# EAGLE design Plata1 (EAGLE 7.5.0)
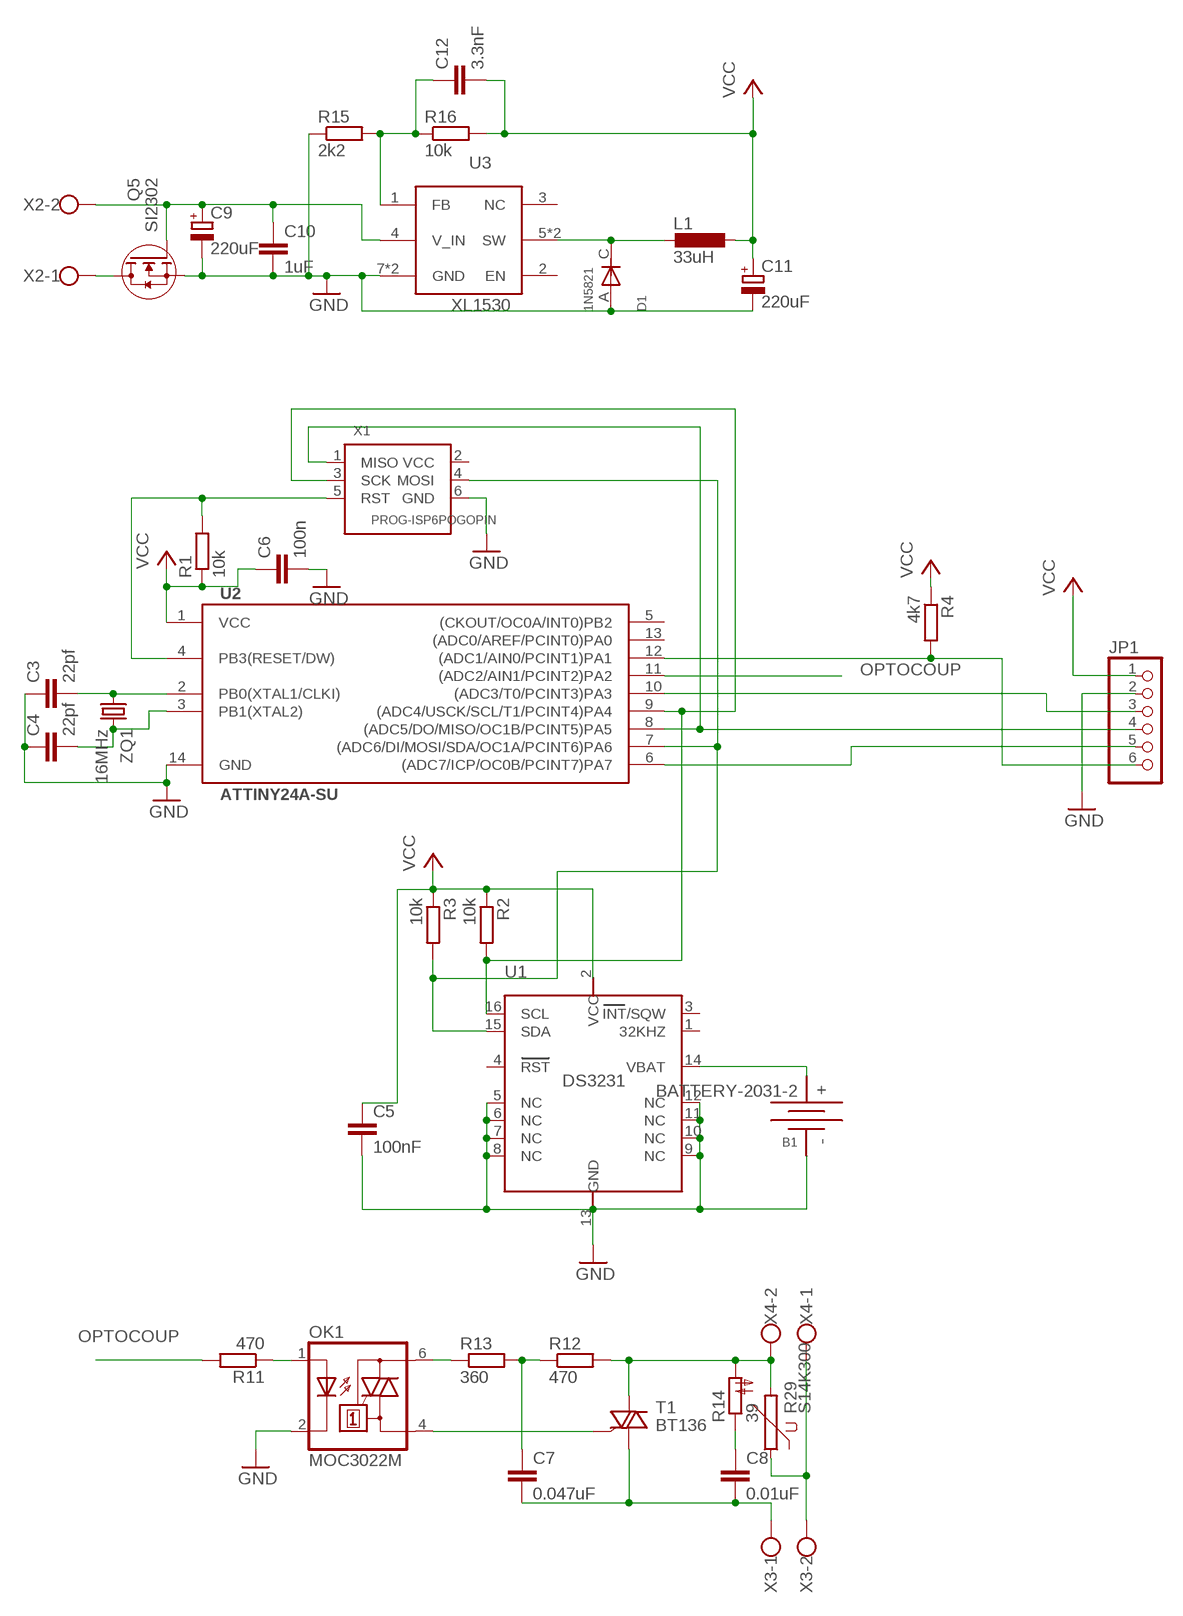
[diagram p0: schematic, sheet 1]

## Parts
B1  BATTERY-2031-2  [BTH2032-2]
C3  22pf  C-EUC0603  [C0603]
C4  22pf  C-EUC0603  [C0603]
C5  100nF  C-EUC0603  [C0603]
C6  100n  C-EUC0603  [C0603]
C7  0.047uF  C-EU150-054X183  [C150-054X183]
C8  0.01uF  C-EU102-043X133  [C102-043X133]
C9  220uF  CPOL-EUE2,5-6E  [E2,5-6E]
C10  1uF  C-EUC0805  [C0805]
C11  220uF  CPOL-EUE2,5-6E  [E2,5-6E]
C12  3.3nF  C-EUC0805  [C0805]
D1  1N5821  DIODESMD  [DO214AC]
JP1  PINHD-1X6  [1X06]
L1  33uH  L-SMD  [L-SMD-D10]
OK1  MOC3022M  [DIL06]
Q5  SI2302  [SOT-23-GSD]
R1  10k  R-EU_R0805  [R0805]
R2  10k  R-EU_R0805  [R0805]
R3  10k  R-EU_R0805  [R0805]
R4  4k7  R-EU_R0805  [R0805]
R11  470  R-EU_R0805  [R0805]
R12  470  R-EU_0207/7  [0207/7]
R13  360  R-EU_0207/7  [0207/7]
R14  39  R-EU_0207/7  [0207/7]
R15  2k2  R-EU_R0603  [R0603]
R16  10k  R-EU_R0603  [R0603]
R29  S14K300  [S14K300]
T1  BT136  [TO220AB]
U1  DS3231  [SO16L]
U2  ATTINY24A-SU  [SO14]
U3  XL1530  [SOP08]
X1  PROG-ISP6POGOPIN  [PROG_POGOPIN]
X2  W237-102  [W237-102]
X3  W237-102  [W237-102]
X4  W237-102  [W237-102]
ZQ1  16MHz  CRYSTALHC49S  [HC49/S]

## Nets
GND: B1.- C3.1 C4.1 C5.2 C6.2 C9.- C10.2 C11.- D1.A(ANOD) JP1.2 OK1.2(C) Q5.S R15.1 U1.5(NC) U1.6(NC) U1.7(NC) U1.8(NC) U1.9(NC) U1.10(NC) U1.11(NC) U1.12(NC) U1.13(GND) U2.14(GND) U3.7(GND) U3.8(GND) X1.6(GND)
N$1: R29.1 X3.2 X4.1
N$2: Q5.D X2.1
N$3: R3.2 U1.15(SDA) U2.7((ADC6/DI/MOSI/SDA/OC1A/PCINT6)PA6) X1.4(MOSI)
N$4: R2.2 U1.16(SCL) U2.9((ADC4/USCK/SCL/T1/PCINT4)PA4) X1.3(SCK)
N$5: R1.2 U2.4(PB3(RESET/DW)) X1.5(RST)
N$7: C3.2 U2.2(PB0(XTAL1/CLKI)) ZQ1.1
N$8: C4.2 U2.3(PB1(XTAL2)) ZQ1.2
N$10: JP1.6 R4.2 U2.12((ADC1/AIN0/PCINT1)PA1)
N$12: C8.1 R14.1
N$13: C7.2 C8.2 T1.1(A1) X3.1
N$14: R12.2 R14.2 R29.2 T1.2(A2) X4.2
N$17: OK1.4(A1) T1.3(G)
N$18: C7.1 R12.1 R13.2
N$19: OK1.6(A2) R13.1
N$21: OK1.1(A) R11.1
N$23: JP1.5 U2.6((ADC7/ICP/OC0B/PCINT7)PA7)
N$24: JP1.4 U2.8((ADC5/DO/MISO/OC1B/PCINT5)PA5) X1.1(MISO)
N$27: JP1.3 U2.10((ADC3/T0/PCINT3)PA3)
N$49: C9.+ C10.1 Q5.G U3.4(V_IN) X2.2
N$53: C12.1 R15.2 R16.1 U3.1(FB)
N$54: D1.C(KATOD) L1.P$2 U3.5(SW) U3.6(SW)
N$56: B1.+ U1.14(VBAT)
OPTOCOUP: R11.2 U2.11((ADC2/AIN1/PCINT2)PA2)
VCC: C5.1 C6.1 C11.+ C12.2 JP1.1 L1.P$1 R1.1 R2.1 R3.1 R4.1 R16.2 U1.2(VCC) U2.1(VCC)
Unconnected: U1.1(32KHZ) U1.3(INT/SQW) U1.4(RST) U2.5((CKOUT/OC0A/INT0)PB2) U2.13((ADC0/AREF/PCINT0)PA0) U3.2(EN) U3.3(NC) X1.2(VCC)

## Library data of the parts
B1 = usb:BATTERY
C3-C8 C10 C12 = rcl:C-EU: CAPACITOR, European symbol
C9 C11 = rcl:CPOL-EU: POLARIZED CAPACITOR, European symbol
D1 = usb:DIODE: DIODE
JP1 = pinhead:PINHD-1X6: PIN HEADER
L1 = usb:L-SMD
OK1 = optocoupler:MOC30*M: RANDOM-PHASE OPTOISOLATORS TRIAC DRIVER OUTPUT Source: http://www.fairchildsemi.com MOC3020-M.pdf; MF: FAIRCHILD SEMICONDUCTOR; MPN: MOC3022-M; OC_FARNELL: 1021086; OC_NEWARK: 58K1956
Q5 = usb:SI2302: N-канальный полевик
R1-R4 R11-R16 = rcl:R-EU_: RESISTOR, European symbol
R29 = varistor:S14K300: VARISTOR
T1 = triac:BT136: Triac BT136 series E sensitive gate Source: http://www.nxp.com/acrobat_download/datasheets/BT136_SERIES_E_2.pdf
U1 = usb:DS3231: Real-Time Clock DS3231
U2 = usb:ATTINY24A: ATTiny24A ATTiny44A ATTiny84A
U3 = usb:XL1530
X1 = usb:PROG-ISP
X2-X4 = con-wago-500:W237-102: WAGO SCREW CLAMP; MPN: 237-102; OC_FARNELL: unknown; OC_NEWARK: 70K9898
ZQ1 = crystal:CRYSTAL: CRYSTAL; OC_FARNELL: 1667008; OC_NEWARK: unknown

## Board
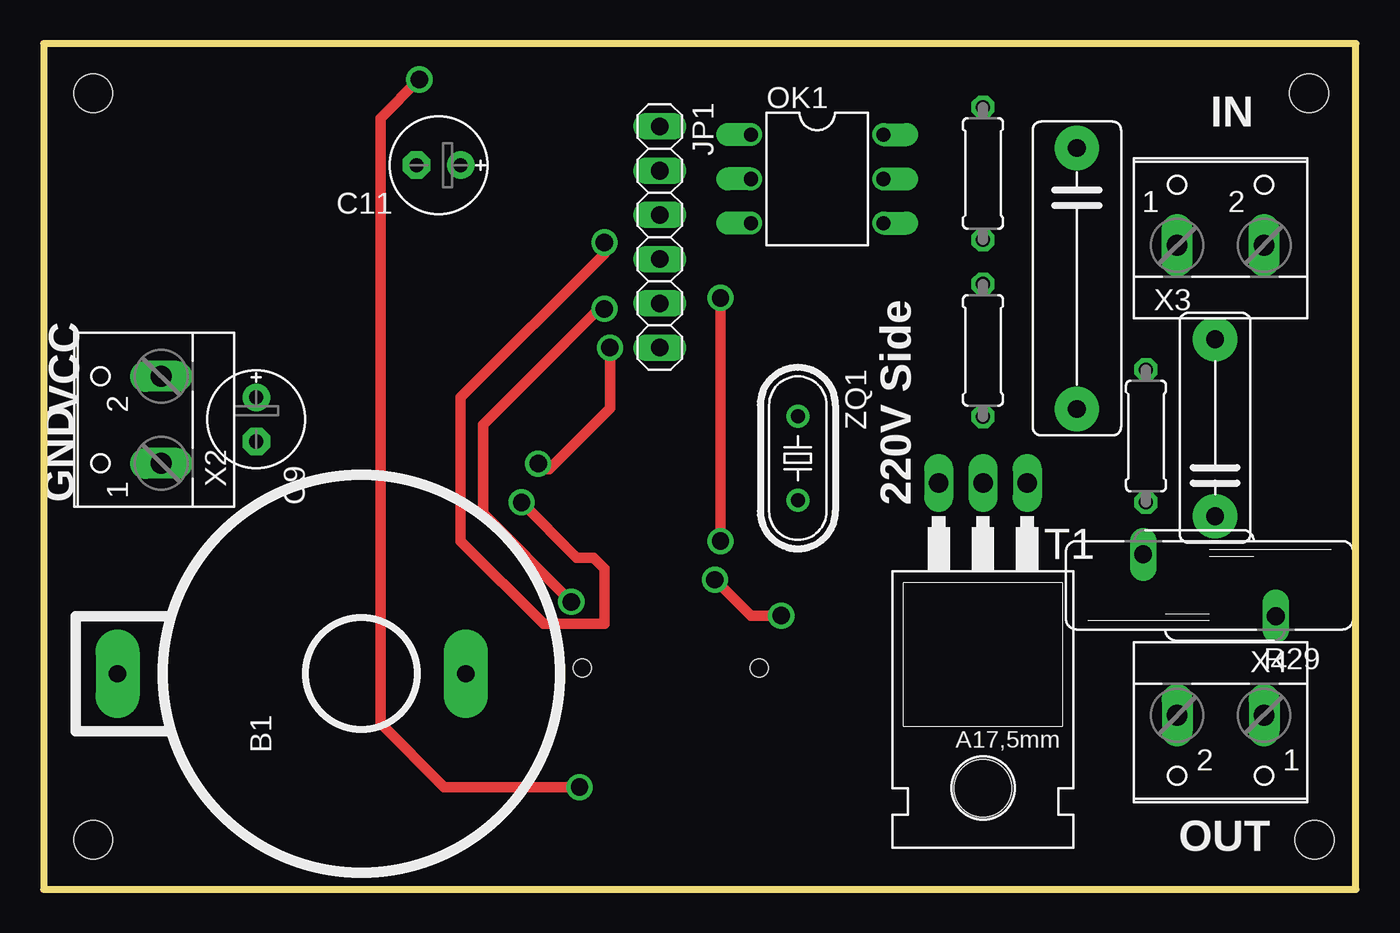
[diagram p1: board, top side]
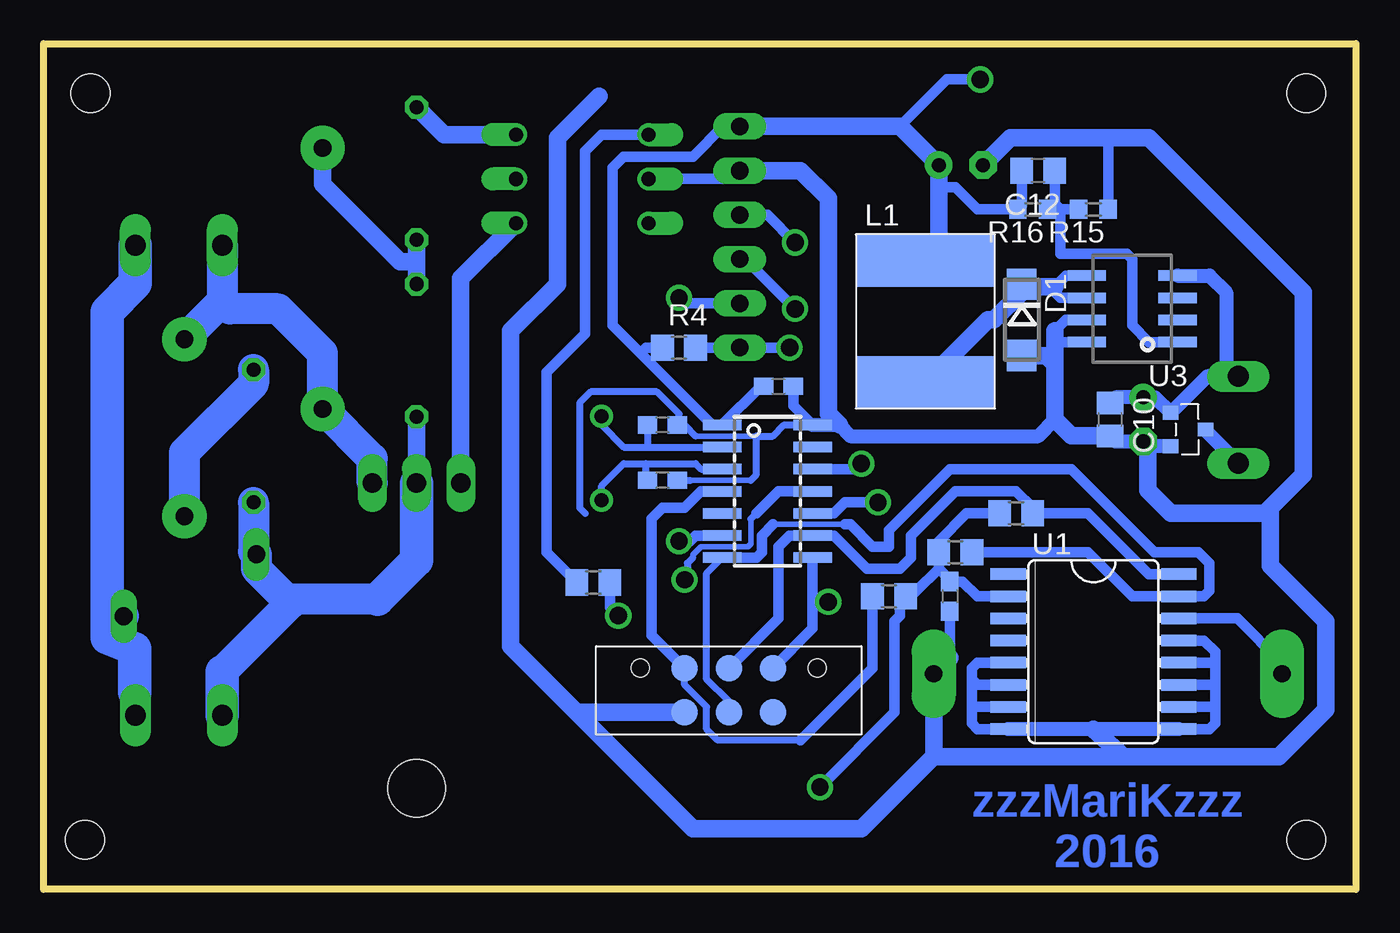
[diagram p2: board, bottom side, seen from below]

Size 75.41 x 48.58 mm. Coordinates in mm from the lower left corner, seen from the top.
Outline: 0,48.58 0,0 75.41,0 75.41,48.58 0,48.58
Copper layers (1*16): Top 0.035mm / dielectric 1.5mm / Bottom 0.035mm
Design rules "default": minimum track width 10mil, minimum drill 24mil, track to track 8mil, track to pad 8mil, pad to pad 8mil, via to via 8mil, smd to smd 8mil, copper to edge 40mil, drill to drill 8mil, minimum pad ring 10mil, minimum via ring 8mil, stop-mask expansion 4mil, vias tented up to drill 0mil, thermal gap 10mil
Holes 2.2 mm at 2.86,45.72 2.86,2.86 73.03,2.86 72.71,45.72

### Footprints (pad centres in the part's own frame; a part is rotated, then mirrored left to right if it is on the bottom)
BTH2032-2 = drill 1 pad 2.54 long: + 0,-14; - 0,6
C0603 = smd 1.1 x 1: 1 -0.85,0; 2 0.85,0
C150-054X183 = drill 1.016 pad 2.54: 1 -7.493,0; 2 7.493,0
C102-043X133 = drill 1.016 pad 2.54: 1 -5.08,0; 2 5.08,0
E2,5-6E = drill 0.813 pad 1.575: + -1.27,0 | drill 0.813 pad 1.575 octagon: - 1.27,0
C0805 = smd 1.3 x 1.5: 1 -0.95,0; 2 0.95,0
DO214AC = smd 1.8 x 1.7: A 2.05,0; C -2.05,0
1X06 = drill 1.016 long: 1 -6.35,0; 2 -3.81,0; 3 -1.27,0; 4 1.27,0; 5 3.81,0; 6 6.35,0
L-SMD-D10 = smd 8 x 3: P$1 4,8.5; P$2 4,1.5
DIL06 = drill 0.813 offset: 1 -2.54,-3.81; 2 0,-3.81; 3 2.54,-3.81; 4 2.54,3.81; 5 0,3.81; 6 -2.54,3.81
SOT-23-GSD = smd 0.8 x 0.9: D 0,2; G -0.95,0; S 0.95,0
R0805 = smd 1.3 x 1.5: 1 -0.95,0; 2 0.95,0
0207/7 = drill 0.813 octagon: 1 -3.81,0; 2 3.81,0
R0603 = smd 1 x 1.1: 1 -0.85,0; 2 0.85,0
S14K300 = drill 1.016 long: 1 -1.778,-3.81; 2 1.778,3.81
TO220AB = drill 1.118 long: 1 -2.54,-6.35; 2 0,-6.35; 3 2.54,-6.35 | hole 3.302: 0,11.176
SO16L = smd 0.66 x 2.032: 1 -4.445,-4.902; 2 -3.175,-4.902; 3 -1.905,-4.902; 4 -0.635,-4.902; 5 0.635,-4.902; 6 1.905,-4.902; 7 3.175,-4.902; 8 4.445,-4.902; 9 4.445,4.902; 10 3.175,4.902; 11 1.905,4.902; 12 0.635,4.902; 13 -0.635,4.902; 14 -1.905,4.902; 15 -3.175,4.902; 16 -4.445,4.902
SO14 = smd 0.6 x 2.2: 1 -3.81,-2.6; 2 -2.54,-2.6; 3 -1.27,-2.6; 4 0,-2.6; 5 1.27,-2.6; 6 2.54,-2.6; 7 3.81,-2.6; 8 3.81,2.6; 9 2.54,2.6; 10 1.27,2.6; 11 0,2.6; 12 -1.27,2.6; 13 -2.54,2.6; 14 -3.81,2.6
SOP08 = smd 0.6 x 2.2: 1 -1.905,-2.6; 2 -0.635,-2.6; 3 0.635,-2.6; 4 1.905,-2.6; 5 1.905,2.6; 6 0.635,2.6; 7 -0.635,2.6; 8 -1.905,2.6
PROG_POGOPIN = smd 1.524 x 1.524: 1 0,7.62; 2 2.54,7.62; 3 0,5.08; 4 2.54,5.08; 5 0,2.54; 6 2.54,2.54 | hole 1.016: 0,0; 0,10.16
W237-102 = drill 1.194 long: 1 -2.5,-1.27; 2 2.5,-1.27
HC49/S = drill 0.813: 1 -2.413,0; 2 2.413,0

### Placement (x,y rotation side)
B1  18.26,12.38 270 top
C3  39.85,26.67 180 bottom
C4  39.85,23.49 180 bottom
C5  23.34,16.83 270 bottom
C6  33.18,28.89 0 bottom
C7  59.37,35.08 270 top
C8  67.31,26.51 90 top
C9  12.22,26.99 270 top
C10  14.13,26.99 270 bottom
C11  22.7,41.59 180 top
C12  18.26,41.28 180 bottom
D1  19.21,32.7 270 bottom
JP1  35.4,37.47 270 top
L1  28.73,27.62 0 bottom
OK1  44.45,40.8 270 top
Q5  10.65,26.41 270 bottom
R1  26.83,16.83 180 bottom
R2  19.53,21.59 0 bottom
R3  23.02,19.37 0 bottom
R4  38.89,31.11 0 bottom
R11  43.81,17.62 0 bottom
R12  53.98,30.96 270 top
R13  53.98,41.12 270 top
R14  63.34,26.04 270 top
R15  15.08,39.05 180 bottom
R16  18.57,39.05 180 bottom
R29  66.99,17.46 90 top
T1  53.98,16.99 180 top
U1  15.08,13.65 270 bottom
U2  33.81,22.86 270 bottom
U3  12.86,33.34 90 bottom
X1  41.12,12.7 270 bottom
X2  5.49,26.97 90 top
X3  67.63,38.26 0 top
X4  67.63,8.73 180 top
ZQ1  43.34,24.77 270 top

### Tracks (layer width: path | path; a pad name or v marks a point on that pad's centre or on a via)
GND
  Bottom 0.254: 38.89,26.99 38.89,26.77 C3.1
  Bottom 0.305: 37.94,26.04 34.45,26.04 | 38.26,23.49 34.77,23.49
  Bottom 0.406: C3.1 38.58,26.67 37.94,26.04 | U2.14 32.86,26.67 33.5,26.04 34.45,26.04 34.45,23.81 34.77,23.49 | C4.1 38.26,23.49 | 38.89,26.99 38.89,27.31 40.16,28.58 43.97,28.58 44.61,27.94 44.61,21.91 44.29,21.59 | 15.08,9.21 14.88,9.21
  Bottom 0.61: C6.2 32.33,27.79 U2.14 | 17.3,32.07 16.67,32.7 U3.7 | U3.8 17.3,31.43 | R15.1 14.23,42.97 14.45,43.18 | U1.11 8.1,11.75 | 8.1,11.75 8.1,13.02 | 8.1,13.02 8.1,13.65 8.73,14.29 U1.13 | U1.9 8.41,9.21 8.1,9.52 8.1,10.48 | U1.10 8.1,10.48 | U1.12 8.1,13.02 | U1.5 21.75,13.02 22.07,12.7 22.07,12.07 | 22.07,12.07 22.07,10.48 | 22.07,10.48 22.07,9.52 21.75,9.21 U1.8 | U1.7 22.07,10.48 | U1.6 21.75,11.75 22.07,12.07 | C5.2 23.34,13.3 | 8.1,11.75 8.1,10.48 | OK1.2 35.88,40.8 JP1.2
  Bottom 0.813: Q5.S 11.97,25.46 C9.- 13.81,25.72 C10.2 | U2.14 29.69,26.67 29.05,26.04 18.26,26.04 17.3,26.99 | 15.08,9.21 U1.8 | U1.9 14.88,9.21 14.98,9.11
  Bottom 1.016: C10.2 16.35,26.04 17.3,26.99 17.3,30.16 | 17.3,30.16 17.3,31.43 17.3,32.07 | D1.A 17.79,30.65 17.3,30.16 | 11.97,25.46 11.97,22.92 10.64,21.59 5.24,21.59 4.92,21.91 | 4.92,21.91 3.02,23.81 3.02,34.29 11.91,43.18 14.45,43.18 19.84,43.18 C11.- | JP1.2 31.91,41.28 30.32,39.69 30.32,27.31 29.69,26.67 | X1.6 44.77,10.16 | 44.77,10.16 48.58,13.97 48.58,32.07 45.88,34.77 45.88,43.18 43.5,45.56 | 24.26,7.65 B1.- 23.34,13.3 | 24.26,7.65 28.42,3.49 38.1,3.49 44.77,10.16 | 4.92,21.91 4.92,18.57 1.75,15.4 1.75,10.32 4.45,7.62 13.34,7.62 | 13.34,7.62 24.22,7.62 24.26,7.65 | 13.34,7.62 15.08,9.21
N$1
  Bottom 0.406: 70.17,11.31 70.17,10.99 X4.1
  Bottom 1.778: R29.1 70.99,15.68 71.75,14.92
  Bottom 1.93: X3.2 70.13,34.81 71.75,33.18 71.75,14.92 71.75,14.45 70.17,13.81 70.17,11.31
N$2
  Bottom 0.813: Q5.D 8.65,26.36 X2.1
N$3
  Bottom 0.305: 33.5,20.95 29.37,20.95
  Bottom 0.406: U2.7 37.31,18.16 37.31,12.07 36.04,10.79 X1.4
  Bottom 0.61: R3.2 15.4,19.37 12.86,16.83 U1.15 8.73,16.83 8.41,17.15 8.41,18.73 9.05,19.37 11.59,19.37 16.35,24.13 23.34,24.13 26.83,20.64 26.83,19.68 27.78,19.68 29.05,20.95 29.37,20.95 | 33.5,20.95 34.13,20.32 34.13,19.37 34.45,19.05 U2.7
N$4
  Bottom 0.61: U1.16 11.91,18.1 15.4,21.59 R2.2 18.58,21.91 19.53,22.86 23.02,22.86 25.56,20.32 25.56,19.05 26.19,18.42 28.1,18.42 30,20.32 U2.9 32.54,20.32 33.18,19.68 33.18,15.56 X1.3
N$5
  Bottom 0.406: 31.91,8.57 36.67,8.57 37.31,9.21 37.31,10.48 38.58,11.75 X1.5 | U2.4 37.62,22.86
  Bottom 0.61: R1.2 27.78,12.7 31.91,8.57 | 37.62,22.86 38.58,21.91 39.85,21.91 40.48,21.27 40.48,14.6 X1.5
N$7
  Bottom 0.406: ZQ1.1 43.34,26.67 42.07,25.4 40.8,25.4 | 40.8,25.4 U2.2 | C3.2 40.7,25.5 40.8,25.4
N$8
  Bottom 0.406: ZQ1.2 43.34,23.18 42.07,24.45 40.8,24.45 | 40.8,24.45 37.94,24.45 37.62,24.13 U2.3 | C4.2 40.8,23.49 40.8,24.45
N$10  (via drill 1)
  Top 0.61: v32.54,31.11 32.54,27.62 29.05,24.13 28.73,24.13 v28.42,24.45
  Bottom 0.61: R4.2 JP1.6 v32.54,31.11 | U2.12 28.73,24.13 v28.42,24.45
N$12
  Bottom 1.778: R14.1 63.34,29.05 67.31,25.08 C8.1
N$13
  Bottom 1.016: C7.2 59.37,27.46
  Bottom 1.778: T1.1 56.52,24.73 C7.2 59.37,30.8 61.91,33.34 64.69,33.34 65.13,33.77 | X3.1 65.13,33.77 | 65.13,33.77 C8.2
N$14
  Bottom 1.016: R12.2 T1.2
  Bottom 1.778: 56.2,16.67 60.96,16.67 61.2,16.43 | 61.2,16.43 65.13,12.5 | 61.2,16.43 63.18,18.42 R29.2 63.34,19.4 R14.2
  Bottom 1.93: T1.2 53.98,18.89 56.2,16.67 | X4.2 65.13,12.5
N$17
  Bottom 1.016: OK1.4 51.44,35.08 T1.3
N$18
  Bottom 1.016: R12.1 53.98,35.72 | 53.98,35.72 R13.2 | C7.1 59.37,40.48 54.93,36.04 54.29,36.04 53.98,35.72
N$19
  Bottom 1.016: OK1.6 52.39,43.34 R13.1
N$21
  Bottom 0.61: OK1.1 43.34,43.34 44.29,42.39 44.29,31.91 46.51,29.69 46.51,19.37 R11.1
N$23  (via drill 1)
  Top 0.61: v38.89,33.97 v38.89,20
  Bottom 0.61: JP1.5 38.58,33.65 v38.89,33.97 | v38.89,20 38.26,20 37.94,20.32 U2.6
N$24  (via drill 1)
  Top 0.61: v32.23,33.34 31.91,33.34 25.24,26.67 25.24,21.59 v30.32,16.51
  Bottom 0.61: U2.8 31.21,16.19 | 31.21,16.19 31.21,14.98 X1.1 | JP1.4 35.08,36.19 v32.23,33.34 | v30.32,16.51 30.9,16.51 31.21,16.19
N$27  (via drill 1)
  Top 0.61: v32.23,37.15 32.23,36.51 23.97,28.26 23.97,20 28.73,15.24 32.23,15.24 32.23,18.42 31.59,19.05 30.64,19.05 v27.46,22.22
  Bottom 0.61: JP1.3 33.81,38.73 v32.23,37.15 | v27.46,22.22 29.37,22.22 30,21.59 U2.10
N$49
  Bottom 0.813: C10.1 13.81,28.26 C9.+ 11.55,28.26 Q5.G 8.54,29.47 X2.2 7.46,30.17 7.46,34.29 8.41,35.24 U3.4
N$53
  Bottom 0.61: R16.1 16.99,39.05 | 16.99,39.05 R15.2 | U3.1 11.91,31.43 12.86,32.39 12.86,36.19 13.18,36.51 16.99,36.51 16.99,39.05 | C12.1 17.31,39.37 16.99,39.05
N$54
  Bottom 0.61: U3.5 16.67,35.24 17.3,34.61 17.3,34.29 16.99,33.97 U3.6
  Bottom 1.016: 17.3,34.61 19.06,34.61 D1.C 19.21,34.29 20.8,32.7 21.15,32.7 L1.P$2
N$56
  Bottom 0.61: B1.+ 4.26,12.99 6.83,15.56 U1.14
OPTOCOUP  (via drill 1)
  Top 0.61: v42.39,15.72 40.64,15.72 v38.58,17.78
  Bottom 0.305: 34.77,21.27 34.77,19.84 34.92,19.68 37.62,19.68 38.1,19.21 38.1,19.05
  Bottom 0.406: 34.45,21.59 34.77,21.27 | 38.1,19.05 38.42,18.73 38.42,17.94 v38.58,17.78
  Bottom 0.61: U2.11 33.18,22.86 34.45,21.59 | R11.2 42.87,16.19 v42.39,15.72
VCC  (via drill 1)
  Top 0.61: v30.8,5.87 23.02,5.87 19.37,9.52 19.37,44.29 v21.59,46.51
  Bottom 0.61: 23.97,40.01 23.65,40.32 23.02,40.32 21.75,39.05 R16.2 19.21,39.27 C12.2 | U1.2 21.75,16.83 22.6,17.68 C5.1 23.34,17.78 23.97,18.42 | 23.97,18.42 R3.1 | R1.1 25.56,16.83 25.24,17.15 | 25.24,17.15 23.97,18.42 | 41.12,30.8 36.99,26.67 U2.1 34.19,28.89 C6.1 | R4.1 40.8,31.11 41.12,30.8 | R3.1 23.97,20.01 22.38,21.59 R2.1 | JP1.1 36.35,43.82 38.1,42.07 42.07,42.07 42.7,41.43 42.7,32.39 41.12,30.8 | R3.1 23.97,18.42 | 25.24,17.15 25.56,17.15 26.19,16.51 26.19,15.72 26.51,15.4 26.51,10.16 v30.8,5.87 | v21.59,46.51 23.5,46.51 26.19,43.82
  Bottom 1.016: L1.P$1 24.66,36.19 24.29,36.19 23.97,36.51 23.97,40.01 C11.+ 26.19,43.82 JP1.1
(copper drawn outside any net)
  shapes: Bottom circle x5

### Text on the board
Bottom: zzzMariKzzz / 2016
tNames: IN | VCC | GND | 220V Side | OUT